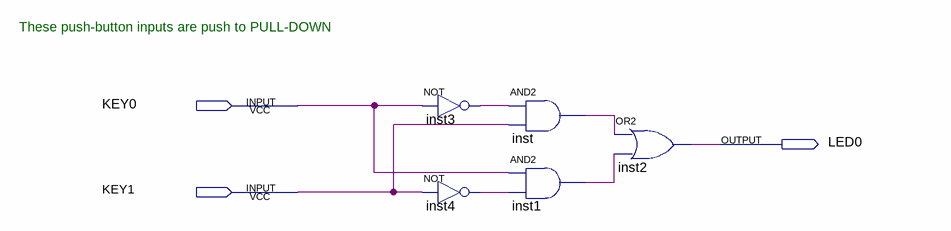
[diagram p0: schematic sheet]
// Quartus schematic comb_logic.bdf as structural Verilog: 5 symbols, 3 pins
module comb_logic (
  input  KEY0,
  input  KEY1,
  output LED0
);

  wire inst1_out, inst3_out, inst4_out, inst_out;

  not inst3 (inst3_out, KEY0);
  not inst4 (inst4_out, KEY1);
  and inst (inst_out, inst3_out, KEY1);
  and inst1 (inst1_out, KEY0, inst4_out);
  or inst2 (LED0, inst_out, inst1_out);

  // Notes on the sheet:
  //   These push-button inputs are push to PULL-DOWN
endmodule
